# EAGLE design usbtiny12v (EAGLE 9.6.2)
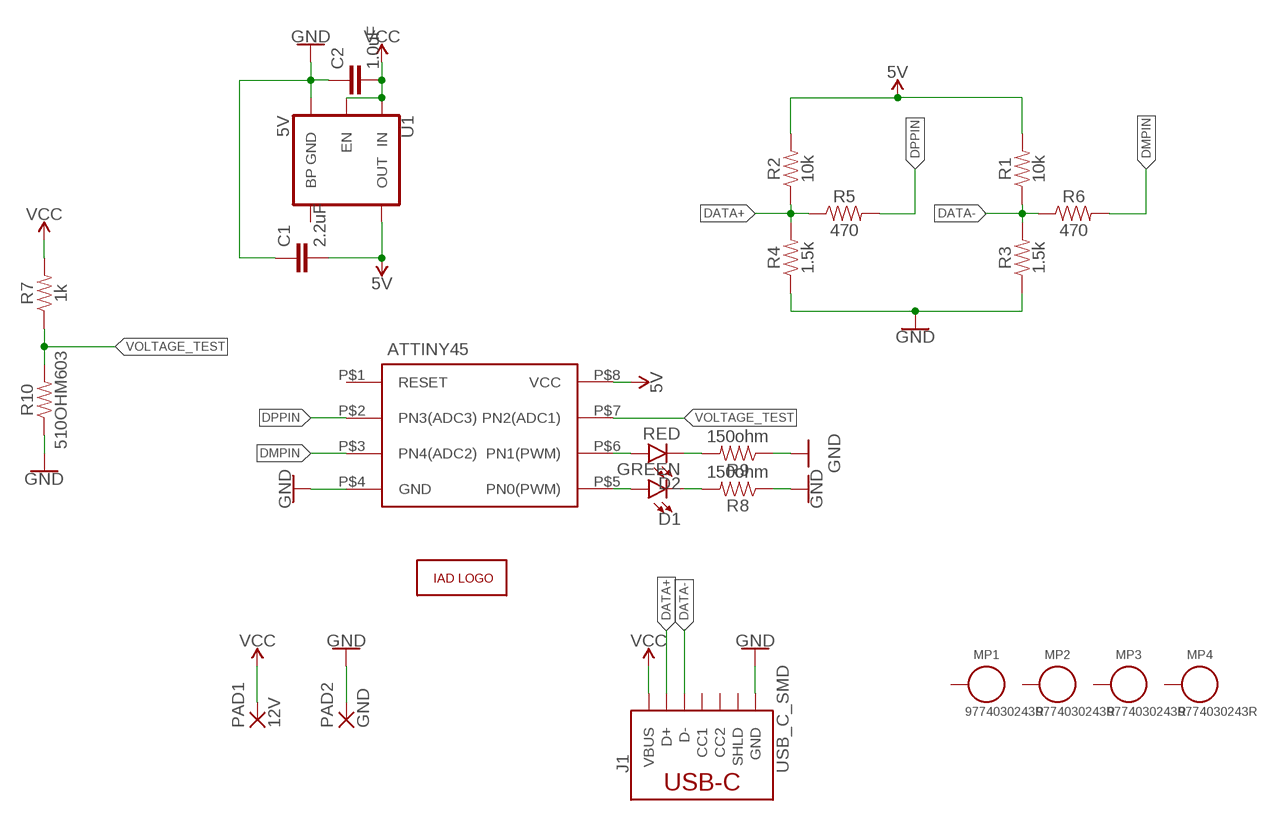
[diagram p0: schematic, sheet 1]

## Parts
C1  2.2uF  2.2UF-1206-50V-10%  [1206]
C2  1.0uF  1.0UF-1206-50V-10%  [1206]
D1  GREEN  LED-GREEN0603  [LED-0603]
D2  RED  LED-RED0603  [LED-0603]
J1  USB_C_SMD  [USB_C_SMD]
MP1  9774030243R  WA-SMSI_9774XXX243_9774030243R  [WA-SMSI_9774030243]
MP2  9774030243R  WA-SMSI_9774XXX243_9774030243R  [WA-SMSI_9774030243]
MP3  9774030243R  WA-SMSI_9774XXX243_9774030243R  [WA-SMSI_9774030243]
MP4  9774030243R  WA-SMSI_9774XXX243_9774030243R  [WA-SMSI_9774030243]
PAD1  12V  SMD5  [SMD2,54-5,08]
PAD2  GND  SMD5  [SMD2,54-5,08]
R1  10k  10KOHM-0603-1/10W-1%  [0603]
R2  10k  10KOHM-0603-1/10W-1%  [0603]
R3  1.5k  1.5KOHM-0603-1/10W-1%  [0603]
R4  1.5k  1.5KOHM-0603-1/10W-1%  [0603]
R5  470  470OHM-0603-1/10W-1%  [0603]
R6  470  470OHM-0603-1/10W-1%  [0603]
R7  1k  1KOHM-0603-1/10W-1%  [0603]
R8  150ohm  510OHM603  [0603]
R9  150ohm  510OHM603  [0603]
R10  510OHM603  [0603]
U1  5V  V_REG_MIC52055V  [SOT23-5]
U2  ATTINY45GULLWINGDIP  [GULLWING_SMD]
U$6  ZHDK_LOGO_METAL  [ZHDK_LOGO]

## Nets
5V: C1.2 R1.2 R2.2 U1.5(OUT) U2.P$8(VCC)
DATA+: J1.A6(D+) J1.B6(D+) R2.1 R4.2 R5.1
DATA-: J1.A7(D-) J1.B7(D-) R1.1 R3.2 R6.1
DMPIN: R6.2 U2.P$3(PN4(ADC2))
DPPIN: R5.2 U2.P$2(PN3(ADC3))
GND: C1.1 C2.1 J1.GND J1.GND2(GND) PAD2.1(P) R3.1 R4.1 R8.1 R9.1 R10.1 U1.2(GND) U2.P$4(GND)
N$1: D1.C R8.2
N$2: D2.A U2.P$6(PN1(PWM))
N$3: D2.C R9.2
N$4: D1.A U2.P$5(PN0(PWM))
VCC [Power]: C2.2 J1.VBUS1(VBUS) J1.VBUS2(VBUS) PAD1.1(P) R7.2 U1.1(IN) U1.3(EN)
VOLTAGE_TEST: R7.1 R10.2 U2.P$7(PN2(ADC1))
Unconnected: J1.A5(CC1) J1.B5(CC2) J1.SHLD1(SHLD) J1.SHLD2(SHLD) J1.SHLD3(SHLD) J1.SHLD4(SHLD) MP1.1 MP2.1 MP3.1 MP4.1 U1.4(BP) U2.P$1(RESET)

## Library data of the parts
C1 = SparkFun-Capacitors:2.2UF: 2.2µF ceramic capacitors A capacitor is a passive two-terminal electrical component used to store electrical energy temporarily in an electric field.; PROD_ID: CAP-10009
C2 = SparkFun-Capacitors:1.0UF: 1µF ceramic capacitors A capacitor is a passive two-terminal electrical component used to store electrical energy temporarily in an electric field.; PROD_ID: CAP-09822
D1 = SparkFun-LED:LED-GREEN: Green SMD LED Used in manufacturing of various products at SparkFun Packages: 0603 - SMD 0603 package [Product Link] <http://www.futureelectronics.com/en/technologies/semiconductors/optoelectronics/leds/Pages/9894312-LTST-C190GKT.aspx?CrossPart=HSMG-C190&IM=0> LilyPad 1206 - SMD1206 LilyPad package [Product Link] <http://www.futureelectronics.com/en/Technologies/Product.aspx?ProductID=IN150NGHARVATEKCORPORATION2049943&IM=0> 1206 - SMD1206 package [Product Link] <http://www.futureelectronics.com/en/technologies/semiconductors/optoelectronics/leds/Pages/8315665-LTST-C150KGKT.aspx?IM=0> 1206 Bottom Mount -SMD 1206 Bottom Mount [Product Link] <http://www.digikey.com/product-detail/en/lite-on-inc/LTST-C230KGKT/160-1456-1-ND/386854> SparkFun Products: Pro Mini 328 -5V <https://www.sparkfun.com/products/821> RedBoard <https://www.sparkfun.com/products/12757> MP3 Trigger <https://www.sparkfun.com/products/13720> Makey Makey <https://www.sparkfun.com/products/11076>; PROD_ID: DIO-00821
D2 = SparkFun-LED:LED-RED: Red SMD LED Used in manufacturing of most products at SparkFun Packages: 0603 - SMD 0603 package [Product Link] <http://docs.avagotech.com/docs/AV02-0551EN> 0603 SMART - SMD 0603 SMART package ( more efficient and expensive)[Product Link] <http://www.osram-os.com/Graphics/XPic2/00077099_0.pdf> 1206 - SMD1206 package [Product Link] <https://www.sparkfun.com/datasheets/DevTools/LilyPad/Q150OVS4.pdff> SparkFun Products: Pro Mini 328 -5V <https://www.sparkfun.com/products/821> RedBoard <https://www.sparkfun.com/products/12757> IOIO-OTG <https://www.sparkfun.com/products/13613>; PROD_ID: DIO-00819
J1 = IAD-Library:USB_C_SMD: USB4110-GF-A (USB TYP C); PARTNO: USB4110-GF-A
MP1-MP4 = Wurth_Assembly_WA-SMSI:WA-SMSI_9774XXX243: WA-SMSI SMT Steel Spacer, M2 Thread Internal PROPERTIES Material Steel Surface Tin GENERAL INFORMATION Operating Temperature -55 up to +150 °C PACKAGING PROPERTIES Packaging Bag;​ Tape and Reel Packaging Unit 1050 <https://katalog.we-online.de/media/images/v2/o92910v209%20Family_WA-SMSI_M2-M2.5.jpg> Details see: https://katalog.we-online.de/en/em/SMSI_SMT_STEEL_SPACER_M2_THREAD_INTERNAL Updated by Ella Wu 2020-05-18 2020(C) Wurth Elektronik; DATASHEET-URL: https://www.we-online.de/katalog/datasheet/9774030243R.pdf; INNER-DIAMETER: 2.8mm; INNER-THREAD-LENGTH: -; OUTER-DIAMETER: 4.35mm; PART-NUMBER: 9774030243R; PIN-LENGTH: 3mm; THREAD: M2
PAD1 PAD2 = wirepad:SMD5: SMD PAD
R1 R2 = SparkFun-Resistors:10KOHM: 10kΩ resistor A resistor is a passive two-terminal electrical component that implements electrical resistance as a circuit element. Resistors act to reduce current flow, and, at the same time, act to lower voltage levels within circuits. - Wikipedia; PROD_ID: RES-00824
R3 R4 = SparkFun-Resistors:1.5KOHM: 1.5kΩ resistor A resistor is a passive two-terminal electrical component that implements electrical resistance as a circuit element. Resistors act to reduce current flow, and, at the same time, act to lower voltage levels within circuits. - Wikipedia; PROD_ID: RES-08306
R5 R6 = SparkFun-Resistors:470OHM: 470Ω resistor A resistor is a passive two-terminal electrical component that implements electrical resistance as a circuit element. Resistors act to reduce current flow, and, at the same time, act to lower voltage levels within circuits. - Wikipedia; PROD_ID: RES-07869
R7 = SparkFun-Resistors:1KOHM: 1kΩ resistor A resistor is a passive two-terminal electrical component that implements electrical resistance as a circuit element. Resistors act to reduce current flow, and, at the same time, act to lower voltage levels within circuits. - Wikipedia; PROD_ID: RES-07856
R8-R10 = SparkFun-Resistors:510OHM603
U1 = SparkFun-IC-Power:V_REG_MIC5205: V_REG MIC5205 Standard 3.3V, 5V, and Adjustable 150mA LDO voltage regulator in SOT-23 layout. Micrel part MIC5205. BP (by-pass) pin is used to lower output noise with 470pF cap, may be left open. On the adjustable version BP is used to set output.; PROD_ID: MIC5235-5.0YM5-TR
U2 = IAD-Library:ATTINY45: Attiny 45 or 85; PARTNO: https://www.digikey.ch/product-detail/en/mill-max-manufacturing-corp/110-47-308-41-105000/ED11083-ND/7363959
U$6 = IAD_GRAPHIC:ZHDK_LOGO_METAL

## Net classes
0 Normal: width 0.3 mm, drill 0.076 mm, clearance 0.1 mm
1 Power: width 0.4 mm, drill 1 mm, clearance 0.3 mm

## Board
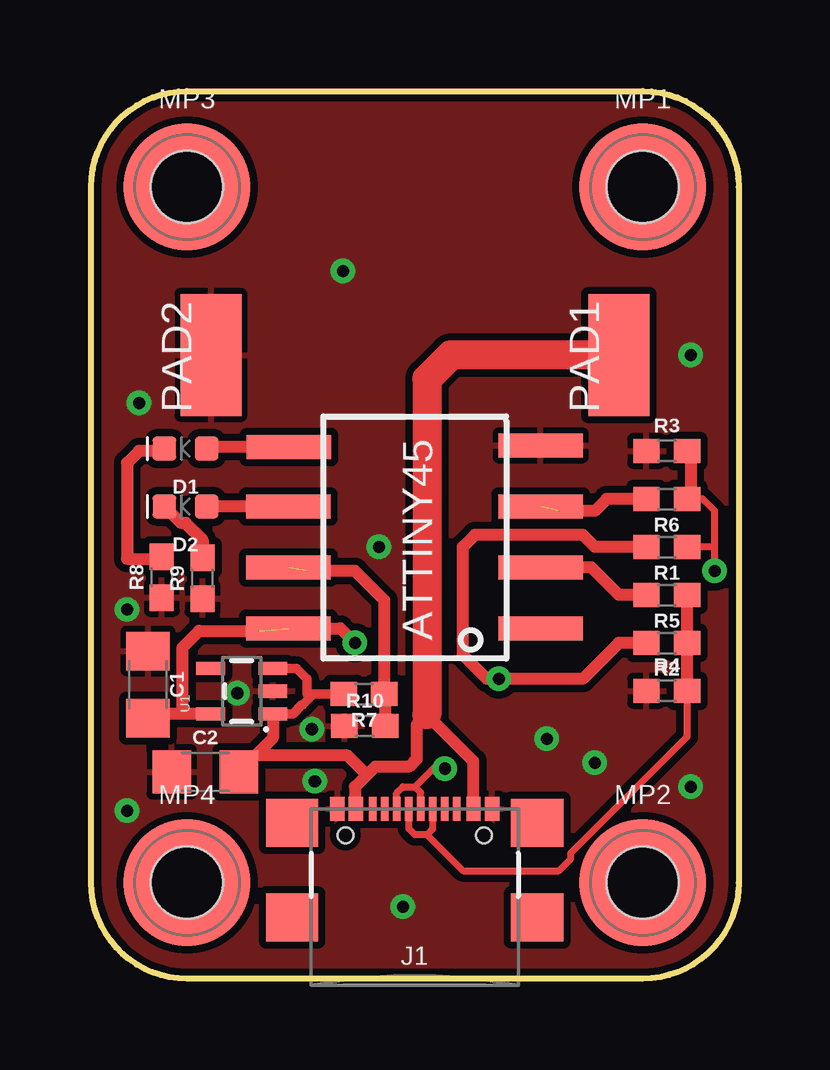
[diagram p1: board, top side]
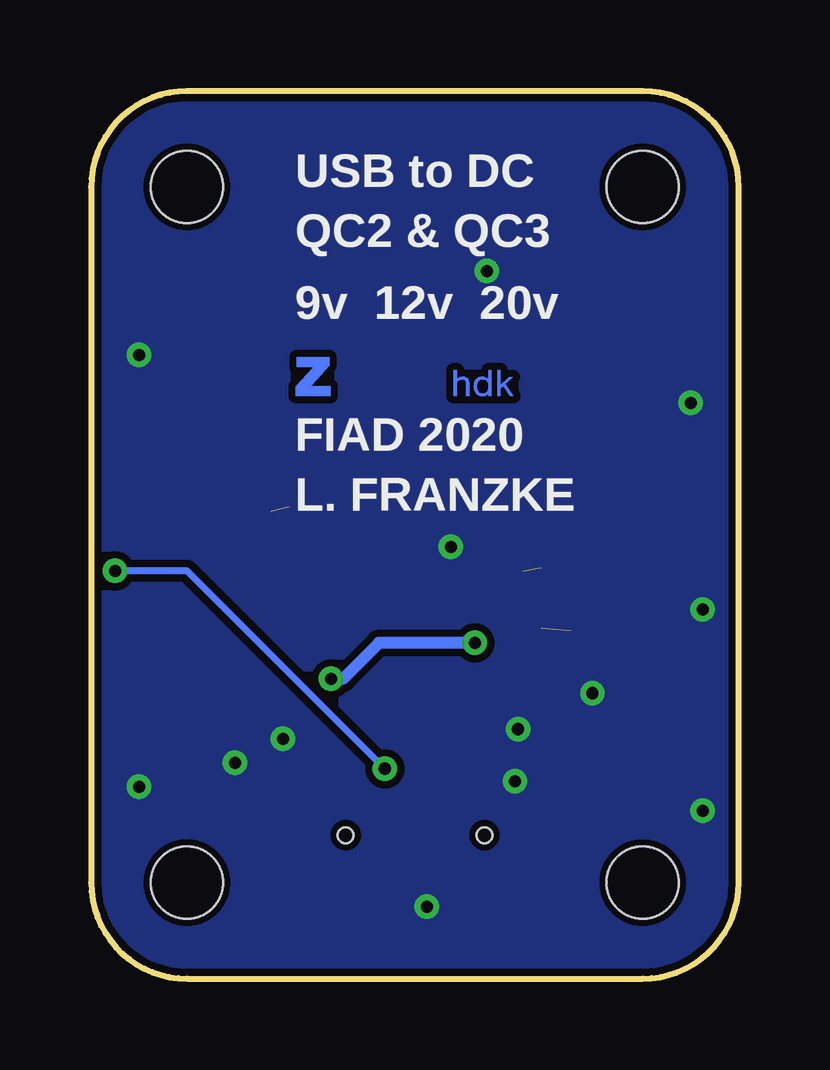
[diagram p2: board, bottom side, seen from below]

Size 27 x 37 mm. Coordinates in mm from the lower left corner, seen from the top.
Outline: 23,0 4,0 arc-90 0,4 0,33 arc-90 4,37 23,37 arc-90 27,33 27,4 arc-90 23,0
Copper layers (1*16): Top 0.035mm / dielectric 1.5mm / Bottom 0.035mm
Design rules "SparkFun": minimum track width 8mil, minimum drill 20mil, track to track 8mil, track to pad 8mil, pad to pad 8mil, via to via 8mil, smd to smd 8mil, copper to edge 10mil, drill to drill 8mil, minimum pad ring 12mil, minimum via ring 10mil, stop-mask expansion 4mil, vias tented up to drill 25mil, thermal gap 10mil

### Footprints (pad centres in the part's own frame; a part is rotated, then mirrored left to right if it is on the bottom)
1206 = smd 1.6 x 1.8: 1 -1.4,0; 2 1.4,0
LED-0603 = smd 1 x 1: A -0.877,0; C 0.877,0
USB_C_SMD = smd 0.3 x 1: A5 -1.25,3.597; A6 -0.25,3.597; A7 0.25,3.597; A8 1.25,3.597; B5 1.75,3.597; B6 0.75,3.597; B7 -0.75,3.597; B8 -1.75,3.597 | smd 0.6 x 1: GND -3.225,3.597; GND2 3.225,3.597; VBUS1 -2.45,3.597; VBUS2 2.45,3.597 | smd 2.18 x 2: SHLD1 -5.11,3; SHLD2 5.11,3; SHLD3 -5.11,-0.93; SHLD4 5.11,-0.93 | hole 0.65: -2.89,2.492; 2.89,2.492
WA-SMSI_9774030243 = smd 5.3 x 5.3: 1 0,0 | hole 3: 0,0
SMD2,54-5,08 = smd 2.54 x 5.08: 1 0,0
0603 = smd 1.1 x 1: 1 -0.85,0; 2 0.85,0
SOT23-5 = smd 0.55 x 1.2: 1 -0.95,-1.3; 2 0,-1.3; 3 0.95,-1.3; 4 0.95,1.3; 5 -0.95,1.3
GULLWING_SMD = smd 3.51 x 1: P$1 -5.243,3.895; P$2 -5.243,1.355; P$3 -5.243,-1.185; P$4 -5.243,-3.725; P$5 5.258,-3.67; P$6 5.273,-1.185; P$7 5.273,1.355; P$8 5.273,3.895

### Placement (x,y rotation side)
C1  2.37,12.25 270 top
C2  4.76,8.62 0 top
D1  3.94,22.1 180 top
D2  3.94,19.68 180 top
J1  13.49,3.49 0 top
MP1  23,33 0 top
MP2  23,4 0 top
MP3  4,33 0 top
MP4  4,4 0 top
PAD1  22,26 0 top
PAD2  5,26 0 top
R1  24,18 180 top
R2  24,14 180 top
R3  24,22 0 top
R4  24,12 0 top
R5  24,16 180 top
R6  24,20 180 top
R7  11.38,11.87 180 top
R8  2.95,16.73 90 top
R9  4.64,16.69 90 top
R10  11.41,10.53 0 top
U1  6.28,11.99 90 top
U2  13.5,18.5 180 top
U$6  19.21,26.48 0 bottom

### Tracks (layer width: path | path; a pad name or v marks a point on that pad's centre or on a via)
5V  (via drill 0.51)  (1 unrouted)
  Top 0.5: U1.5 4,11.04 | 4,11.04 2.4,11.04 C1.2 | R1.2 21,18 20.5,18.5 16,18.5 15.5,18 15.5,13.5 16.5,12.5 v17,12.5 20.5,12.5 22,14 R2.2 | U2.P$8 10.39,14.61 v11,14 | 4,11.04 3.81,11.23 3.81,13.81 4.5,14.5 7,14.5
  Bottom 0.5: v11,14 15,14 16.5,12.5 v17,12.5
DATA+
  Top 0.3: J1.B6 14.24,6.24 14,6 | 14,6 13.5,6 13.24,6.26 J1.A6 | 14,6 15.5,4.5 19.5,4.5 20,5 20,5.24 24.85,10.1 R4.2
  Top 0.5: R5.1 R2.1 R4.2
DATA-  (via drill 0.51)
  Top 0.3: J1.A7 13.74,7.76 13.5,8 | 13.5,8 13,8 12.74,7.74 J1.B7 | 13.5,8 14.5,9 v14.75,8.75 | v26,17 26,18 | 26,18 26,19.5 25.5,20 25,20 R6.1 | 26,18 R1.1
  Top 0.5: R3.2 25,21.85 25,20
  Bottom 0.3: v14.75,8.75 23,17 v26,17
DMPIN  (1 unrouted)
  Top 0.5: R6.2 21.5,20 21,19.5 19.5,19.5
DPPIN
  Top 0.5: R5.2 22,16 20.86,17.14 U2.P$2
GND  (via drill 0.51)
  other vias: 19,10 1.5,7 12,18 9.2,10.4 13,3 25,26 6.1,11.9 10.5,29.5 21,9 25,8 1.5,15.39 2,24 9.33,8.23
  pour Top (isolate 0.305): -2,38 29,38 29,-1 -2,-1
  pour Bottom (isolate 0.305): -3,39 30,39 30,-2 -3,-2
N$1
  Top 0.5: D1.C 2.96,22 2,22 1.5,21.5 1.5,17.5 2.87,17.5 R8.2
N$2
  Top 0.5: U2.P$6 D2.A | D2.A
N$3
  Top 0.5: D2.C 3.75,19 3.95,19 4.64,18.3 R9.2
N$4
  Top 0.5: U2.P$5 4.89,22.17 D1.A
VCC
  Top 0.4: U1.3 8.56,12.94 9,12.5 9,11.88 9.02,11.87 9.27,11.87 | R7.2 9.27,11.87 | 9.27,11.87 8.81,11.41 8.78,11.41 8.41,11.04 U1.1
  Top 0.5: J1.VBUS2 15.94,9.06 14,11 13.57,10.57 13.57,9.16 13.25,8.84 11.84,8.84 11.5,8.5 | J1.VBUS1 11,7.13 11,8 11.5,8.5 | 7.62,11 U1.1 7.58,10.04 C2.2 6.84,9.3 10.7,9.3 11.5,8.5
  Top 1.2: PAD1.1 15,26 14,25 14,11
VOLTAGE_TEST  (1 unrouted)
  Top 0.5: R10.2 12.26,11.84 R7.1 12.23,15.77 11,17 9,17

### Text on the board
bNames: USB to DC | QC2 & QC3 | 9v 12v 20v | FIAD 2020 | L. FRANZKE